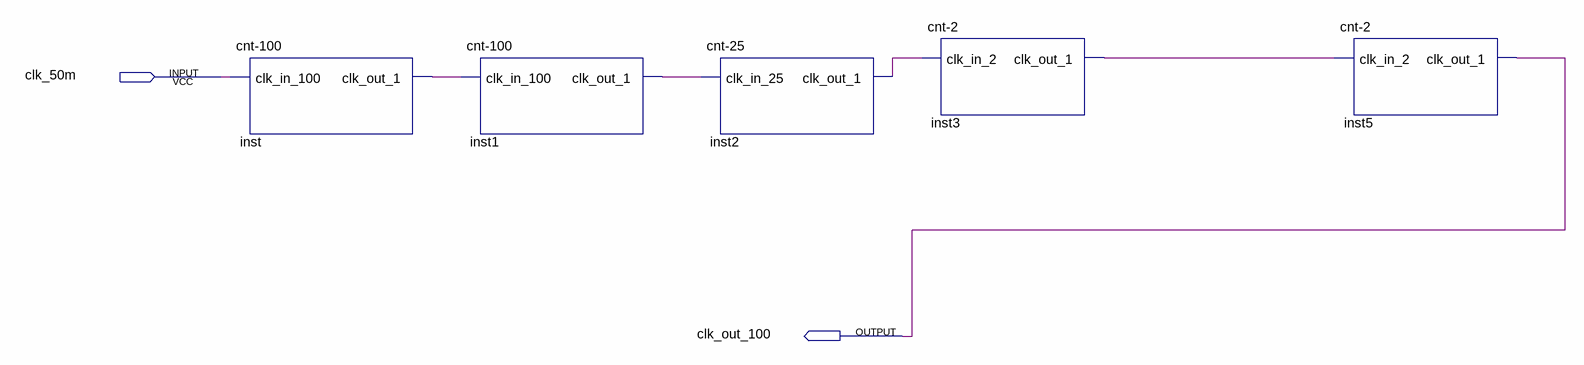
[diagram p0: schematic sheet]
// Quartus schematic clk_25.bdf as structural Verilog: 5 symbols, 2 pins
module clk_25 (
  input  clk_50m,
  output clk_out_100
);

  wire inst1_clk_out_1, inst2_clk_out_1, inst3_clk_out_1, inst_clk_out_1;

  \cnt-100  inst (.clk_in_100(clk_50m), .clk_out_1(inst_clk_out_1));
  \cnt-100  inst1 (.clk_in_100(inst_clk_out_1), .clk_out_1(inst1_clk_out_1));
  \cnt-25  inst2 (.clk_in_25(inst1_clk_out_1), .clk_out_1(inst2_clk_out_1));
  \cnt-2  inst3 (.clk_in_2(inst2_clk_out_1), .clk_out_1(inst3_clk_out_1));
  \cnt-2  inst5 (.clk_in_2(inst3_clk_out_1), .clk_out_1(clk_out_100));
endmodule
